# EAGLE design mTouch LED board I2C v1.1_1 (EAGLE 5.10)
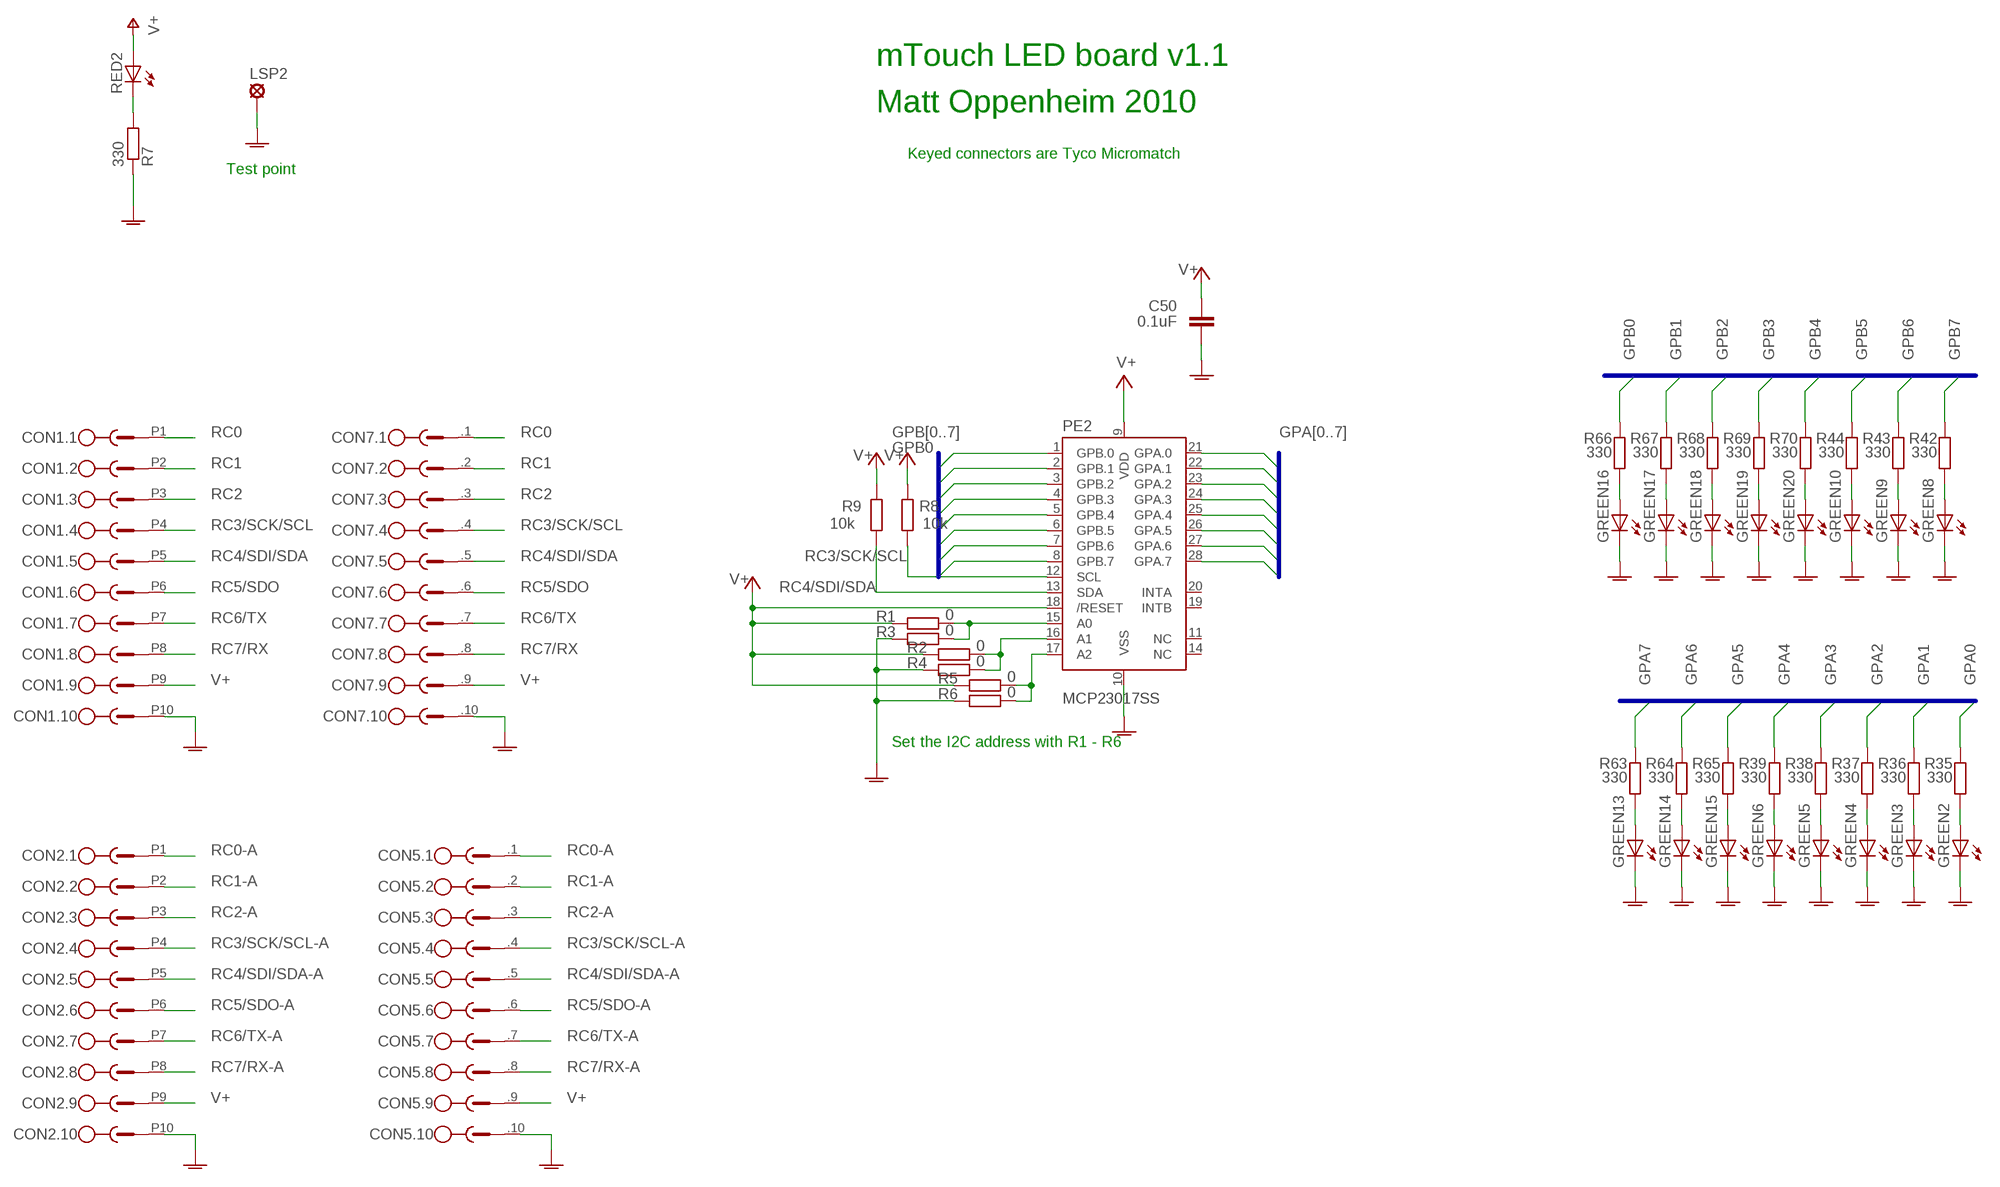
[diagram p0: schematic, sheet 1]

## Parts
C50  0.1uF  C-EUC0603  [C0603]
CON1  MICROMATCH_10HORIZONTAL  [MICROMATCH-10H]
CON2  MICROMATCH_10HORIZONTAL  [MICROMATCH-10H]
CON5  MICROMATCH_10PLUG  [MICROMATCH-10H-PLUG]
CON7  MICROMATCH_10PLUG  [MICROMATCH-10H-PLUG]
GREEN2  LEDCHIP-LED0603  [CHIP-LED0603]
GREEN3  LEDCHIP-LED0603  [CHIP-LED0603]
GREEN4  LEDCHIP-LED0603  [CHIP-LED0603]
GREEN5  LEDCHIP-LED0603  [CHIP-LED0603]
GREEN6  LEDCHIP-LED0603  [CHIP-LED0603]
GREEN8  LEDCHIP-LED0603  [CHIP-LED0603]
GREEN9  LEDCHIP-LED0603  [CHIP-LED0603]
GREEN10  LEDCHIP-LED0603  [CHIP-LED0603]
GREEN13  LEDCHIP-LED0603  [CHIP-LED0603]
GREEN14  LEDCHIP-LED0603  [CHIP-LED0603]
GREEN15  LEDCHIP-LED0603  [CHIP-LED0603]
GREEN16  LEDCHIP-LED0603  [CHIP-LED0603]
GREEN17  LEDCHIP-LED0603  [CHIP-LED0603]
GREEN18  LEDCHIP-LED0603  [CHIP-LED0603]
GREEN19  LEDCHIP-LED0603  [CHIP-LED0603]
GREEN20  LEDCHIP-LED0603  [CHIP-LED0603]
LSP2  LSP10  [LSP10]
PE2  MCP23017SS  [SSOP28]
R1  0  R-EU_R0603  [R0603]
R2  0  R-EU_R0603  [R0603]
R3  0  R-EU_R0603  [R0603]
R4  0  R-EU_R0603  [R0603]
R5  0  R-EU_R0603  [R0603]
R6  0  R-EU_R0603  [R0603]
R7  330  R-EU_R0603  [R0603]
R8  10k  R-EU_R0603  [R0603]
R9  10k  R-EU_R0603  [R0603]
R35  330  R-EU_R0603  [R0603]
R36  330  R-EU_R0603  [R0603]
R37  330  R-EU_R0603  [R0603]
R38  330  R-EU_R0603  [R0603]
R39  330  R-EU_R0603  [R0603]
R42  330  R-EU_R0603  [R0603]
R43  330  R-EU_R0603  [R0603]
R44  330  R-EU_R0603  [R0603]
R63  330  R-EU_R0603  [R0603]
R64  330  R-EU_R0603  [R0603]
R65  330  R-EU_R0603  [R0603]
R66  330  R-EU_R0603  [R0603]
R67  330  R-EU_R0603  [R0603]
R68  330  R-EU_R0603  [R0603]
R69  330  R-EU_R0603  [R0603]
R70  330  R-EU_R0603  [R0603]
RED2  LEDCHIP-LED0603  [CHIP-LED0603]

## Nets
A0: PE2.15(A0) R1.2 R3.1
A1: PE2.16(A1) R2.2 R4.2
A2: PE2.17(A2) R5.2 R6.2
AGND: C50.1 CON1.P10 CON2.P10 CON5..10 CON7..10 GREEN2.C GREEN3.C GREEN4.C GREEN5.C GREEN6.C GREEN8.C GREEN9.C GREEN10.C GREEN13.C GREEN14.C GREEN15.C GREEN16.C GREEN17.C GREEN18.C GREEN19.C GREEN20.C LSP2.MP PE2.10(VSS) R3.2 R4.1 R6.1 R7.1
GPA0: PE2.21(GPA.0) R35.2
GPA1: PE2.22(GPA.1) R36.2
GPA2: PE2.23(GPA.2) R37.2
GPA3: PE2.24(GPA.3) R38.2
GPA4: PE2.25(GPA.4) R39.2
GPA5: PE2.26(GPA.5) R65.2
GPA6: PE2.27(GPA.6) R64.2
GPA7: PE2.28(GPA.7) R63.2
GPB0: PE2.1(GPB.0) R66.2
GPB1: PE2.2(GPB.1) R67.2
GPB2: PE2.3(GPB.2) R68.2
GPB3: PE2.4(GPB.3) R69.2
GPB4: PE2.5(GPB.4) R70.2
GPB5: PE2.6(GPB.5) R44.2
GPB6: PE2.7(GPB.6) R43.2
GPB7: PE2.8(GPB.7) R42.2
N$4: R7.2 RED2.C
N$62: GREEN10.A R44.1
N$63: GREEN9.A R43.1
N$64: GREEN8.A R42.1
N$67: GREEN6.A R39.1
N$68: GREEN5.A R38.1
N$69: GREEN4.A R37.1
N$70: GREEN3.A R36.1
N$71: GREEN2.A R35.1
N$107: GREEN20.A R70.1
N$108: GREEN19.A R69.1
N$109: GREEN18.A R68.1
N$110: GREEN17.A R67.1
N$111: GREEN16.A R66.1
N$112: GREEN15.A R65.1
N$113: GREEN14.A R64.1
N$114: GREEN13.A R63.1
RC0: CON1.P1 CON7..1
RC0-A: CON2.P1 CON5..1
RC1: CON1.P2 CON7..2
RC1-A: CON2.P2 CON5..2
RC2: CON1.P3 CON7..3
RC2-A: CON2.P3 CON5..3
RC3/SCK/SCL: CON1.P4 CON7..4 PE2.12(SCL) R8.1
RC3/SCK/SCL-A: CON2.P4 CON5..4
RC4/SDI/SDA: CON1.P5 CON7..5 PE2.13(SDA) R9.1
RC4/SDI/SDA-A: CON2.P5 CON5..5
RC5/SDO: CON1.P6 CON7..6
RC5/SDO-A: CON2.P6 CON5..6
RC6/TX: CON1.P7 CON7..7
RC6/TX-A: CON2.P7 CON5..7
RC7/RX: CON1.P8 CON7..8
RC7/RX-A: CON2.P8 CON5..8
V+: C50.2 CON1.P9 CON2.P9 CON5..9 CON7..9 PE2.9(VDD) PE2.18(/RESET) R1.1 R2.1 R5.1 R8.2 R9.2 RED2.A
Unconnected: PE2.11(NC) PE2.14(NC) PE2.19(INTB) PE2.20(INTA)

## Buses
GPB[0..7]
GPA[0..7]

## Notes on the sheet
- mTouch LED board v1.1
- Matt Oppenheim 2010
- Keyed connectors are Tyco Micromatch
- Test point
- Set the I2C address with R1 - R6

## Library data of the parts
C50 = rcl:C-EU: CAPACITOR, European symbol
CON1 CON2 CON5 CON7 = con-Micromatch:MICROMATCH_10: MicroMatch 10 way Tyco Electronics, Farnell 148600
GREEN2-GREEN6 GREEN8-GREEN10 GREEN13-GREEN20 RED2 = led:LED: LED OSRAM: - CHIPLED LG R971, LG N971, LY N971, LG Q971, LY Q971, LO R971, LY R971 LH N974, LH R974 LS Q976, LO Q976, LY Q976 LO Q996 - Hyper CHIPLED LW Q18S LB Q993, LB Q99A, LB R99A - SideLED LS A670, LO A670, LY A670, LG A670, LP A670 LB A673, LV A673, LT A673, LW A673 LH A674 LY A675 LS A676, LA A676, LO A676, LY A676, LW A676 LS A679, LY A679, LG A679 - Hyper Micro SIDELED® LS Y876, LA Y876, LO Y876, LY Y876 LT Y87S - SmartLED LW L88C, LW L88S LB L89C, LB L89S, LG L890 LS L89K, LO L89K, LY L89K LS L896, LA L896, LO L896, LY L896 - TOPLED LS T670, LO T670, LY T670, LG T670, LP T670 LSG T670, LSP T670, LSY T670, LOP T670, LYG T670 LG T671, LOG T671, LSG T671 LB T673, LV T673, LT T673, LW T673 LH T674 LS T676, LA T676, LO T676, LY T676, LB T676, LH T676, LSB T676, LW T676 LB T67C, LV T67C, LT T67C, LS T67K, LO T67K, LY T67K, LW E67C LS E67B, LA E67B, LO E67B, LY E67B, LB E67C, LV E67C, LT E67C LW T67C LS T679, LY T679, LG T679 LS T770, LO T770, LY T770, LG T770, LP T770 LB T773, LV T773, LT T773, LW T773 LH T774 LS E675, LA E675, LY E675, LS T675 LS T776, LA T776, LO T776, LY T776, LB T776 LHGB T686 LT T68C, LB T68C - Hyper Mini TOPLED® LB M676 - Mini TOPLED Santana® LG M470 LS M47K, LO M47K, LY M47K Source: http://www.osram.convergy.de LUXEON: - LUMILED® LXK2-PW12-R00, LXK2-PW12-S00, LXK2-PW14-U00, LXK2-PW14-V00 LXK2-PM12-R00, LXK2-PM12-S00, LXK2-PM14-U00 LXK2-PE12-Q00, LXK2-PE12-R00, LXK2-PE12-S00, LXK2-PE14-T00, LXK2-PE14-U00 LXK2-PB12-K00, LXK2-PB12-L00, LXK2-PB12-M00, LXK2-PB14-N00, LXK2-PB14-P00, LXK2-PB14-Q00 LXK2-PR12-L00, LXK2-PR12-M00, LXK2-PR14-Q00, LXK2-PR14-R00 LXK2-PD12-Q00, LXK2-PD12-R00, LXK2-PD12-S00 LXK2-PH12-R00, LXK2-PH12-S00 LXK2-PL12-P00, LXK2-PL12-Q00, LXK2-PL12-R00 Source: www.luxeon.com KINGBRIGHT: KA-3528ASYC Source: www.kingbright.com
LSP2 = Momo:LSP10: SOLDER PAD drill 1.0 mm, distributor Buerklin, 12H555
PE2 = Touch Sensors:MCP23017: MCP23o17 16 bit I/O Expander with I2C Microchip
R1-R9 R35-R39 R42-R44 R63-R70 = rcl:R-EU_: RESISTOR, European symbol

## Board
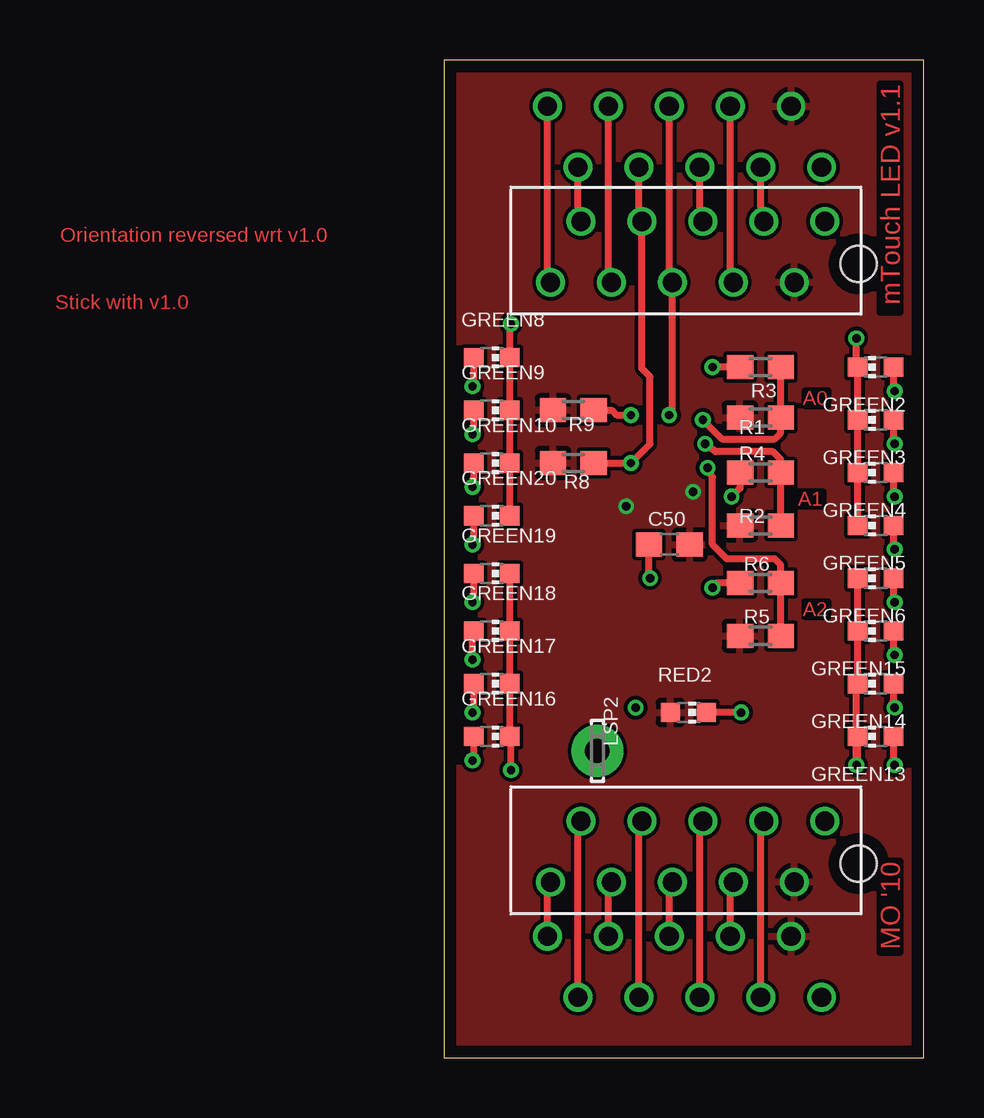
[diagram p1: board, top side]
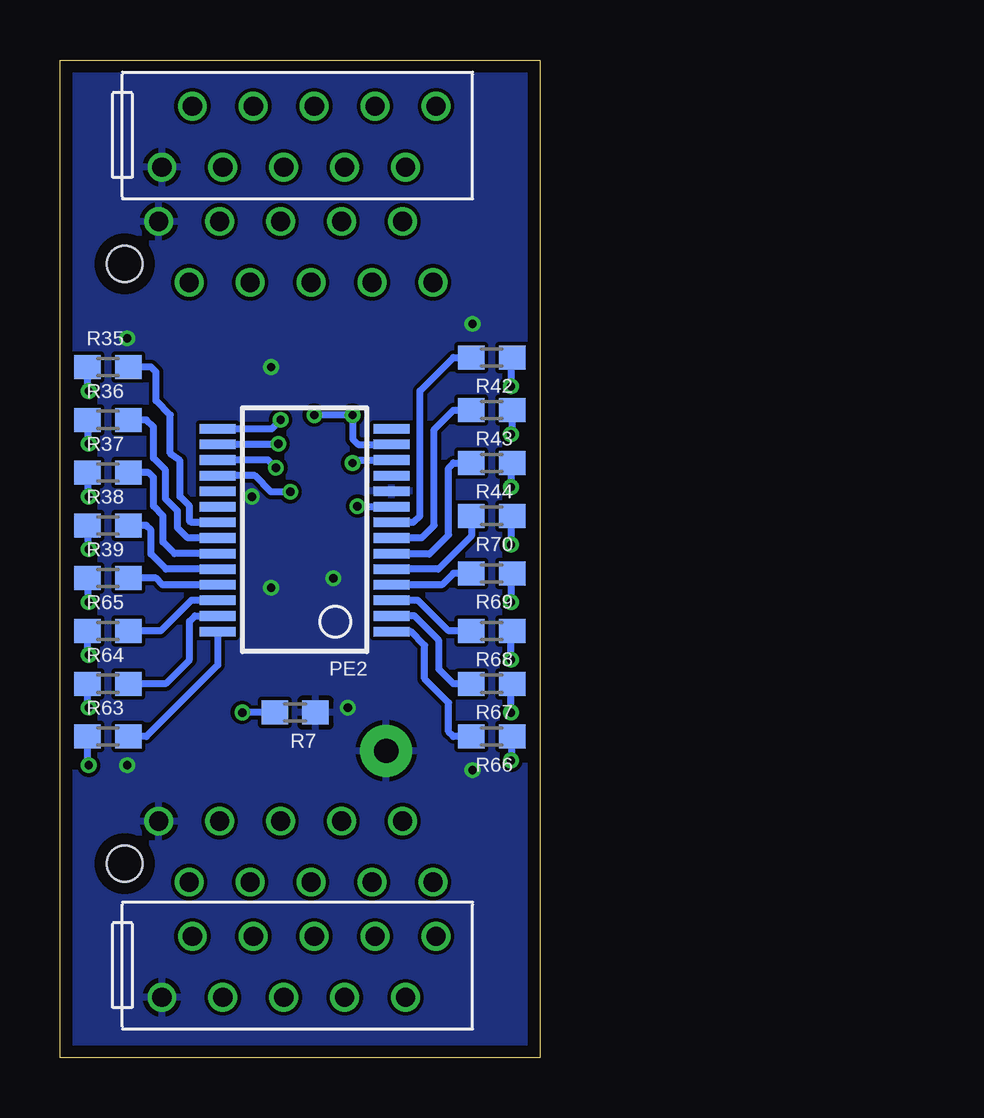
[diagram p2: board, bottom side, seen from below]

Size 20 x 41.6 mm. Coordinates in mm from the lower left corner, seen from the top.
Outline: 20,41.6 0,41.6 0,0 20,0 20,41.6
Copper layers (1*16): Top 0.035mm / dielectric 1.5mm / Bottom 0.035mm
Design rules "PCB-POOL - 2 layer, edited *": minimum track width 6mil, minimum drill 12mil, track to track 6mil, track to pad 8mil, pad to pad 6mil, via to via 6mil, smd to smd 6mil, copper to edge 20mil, drill to drill 8mil, minimum pad ring 8mil, minimum via ring 6mil, stop-mask expansion 3mil, vias tented up to drill 0.35mm, thermal gap 8mil

### Footprints (pad centres in the part's own frame; a part is rotated, then mirrored left to right if it is on the bottom)
C0603 = smd 1.1 x 1: 1 -0.85,0; 2 0.85,0
MICROMATCH-10H = drill 0.8 round: P1 -6.35,-1.27; P2 -5.08,1.27; P3 -3.81,-1.27; P4 -2.54,1.27; P5 -1.27,-1.27; P6 0,1.27; P7 1.27,-1.27; P8 2.54,1.27; P9 3.81,-1.27; P10 5.08,1.27 | hole 1.5: 6.5,-0.5
MICROMATCH-10H-PLUG = drill 0.8 round: .1 5.08,1.27; .2 3.81,-1.27; .3 2.54,1.27; .4 1.27,-1.27; .5 0,1.27; .6 -1.27,-1.27; .7 -2.54,1.27; .8 -3.81,-1.27; .9 -5.08,1.27; .10 -6.35,-1.27
CHIP-LED0603 = smd 0.8 x 0.8: A 0,-0.75; C 0,0.75
LSP10 = drill 1.016 pad 2.159 round: MP 0,0
SSOP28 = smd 0.4 x 1.5: 1 -4.225,-3.625; 2 -3.575,-3.625; 3 -2.925,-3.625; 4 -2.275,-3.625; 5 -1.625,-3.625; 6 -0.975,-3.625; 7 -0.325,-3.625; 8 0.325,-3.625; 9 0.975,-3.625; 10 1.625,-3.625; 11 2.275,-3.625; 12 2.925,-3.625; 13 3.575,-3.625; 14 4.225,-3.625; 15 4.225,3.625; 16 3.575,3.625; 17 2.925,3.625; 18 2.275,3.625; 19 1.625,3.625; 20 0.975,3.625; 21 0.325,3.625; 22 -0.325,3.625; 23 -0.975,3.625; 24 -1.625,3.625; 25 -2.275,3.625; 26 -2.925,3.625; 27 -3.575,3.625; 28 -4.225,3.625
R0603 = smd 1.1 x 1: 1 -0.85,0; 2 0.85,0

### Placement (x,y rotation side)
C50  9.4,21.4 0 top
CON1  10.8,33.6 0 top
CON2  10.8,8.6 0 top
CON5  9.4,3.8 0 bottom
CON7  9.4,38.4 0 bottom
GREEN2  18,28.8 90 top
GREEN3  18,26.6 90 top
GREEN4  18,24.4 90 top
GREEN5  18,22.2 90 top
GREEN6  18,20 90 top
GREEN8  2,29.2 270 top
GREEN9  2,27 270 top
GREEN10  2,24.8 270 top
GREEN13  18,13.4 90 top
GREEN14  18,15.6 90 top
GREEN15  18,17.8 90 top
GREEN16  2,13.4 270 top
GREEN17  2,15.6 270 top
GREEN18  2,17.8 270 top
GREEN19  2,20.2 270 top
GREEN20  2,22.6 270 top
LSP2  6.4,12.8 270 top
PE2  9.8,22 90 bottom
R1  13.2,26.7 0 top
R2  13.2,22.2 0 top
R3  13.2,28.8 180 top
R4  13.2,24.4 0 top
R5  13.2,17.6 0 top
R6  13.2,19.8 0 top
R7  10.2,14.4 180 bottom
R8  5.4,24.8 180 top
R9  5.4,27 180 top
R35  18,28.8 0 bottom
R36  18,26.6 0 bottom
R37  18,24.4 0 bottom
R38  18,22.2 0 bottom
R39  18,20 0 bottom
R42  2,29.2 180 bottom
R43  2,27 180 bottom
R44  2,24.8 180 bottom
R63  18,13.4 0 bottom
R64  18,15.6 0 bottom
R65  18,17.8 0 bottom
R66  2,13.4 180 bottom
R67  2,15.6 180 bottom
R68  2,17.8 180 bottom
R69  2,20.2 180 bottom
R70  2,22.6 180 bottom
RED2  10.2,14.4 270 top

### Tracks (layer width: path | path; a pad name or v marks a point on that pad's centre or on a via)
A0  (via drill 0.35)
  Top 0.3: R3.1 R1.2 14.05,26.05 13.8,25.8 11.6,25.8 v10.8,26.6
  Bottom 0.3: PE2.15 11.18,26.23 v10.8,26.6
A1  (via drill 0.35)
  Top 0.3: R2.2 R4.2 14.05,24.95 13.72,25.27 11.32,25.27 v10.9,25.6
  Bottom 0.3: PE2.16 11.18,25.57 v10.9,25.6
A2  (via drill 0.35)
  Top 0.3: R5.2 R6.2 14.05,20.55 13.8,20.8 11.8,20.8 11.2,21.4 11.2,24.2 v11,24.6
  Bottom 0.3: PE2.17 11.32,24.93 v11,24.6
AGND  (via drill 0.35)
  Top 0.3: R6.1 11.4,19.8 v11.2,19.6 | R3.2 v11.2,28.8 | R4.1 12.35,23.75 v12,23.4 | v17.2,30 17.2,28.85 GREEN2.C GREEN3.C GREEN4.C GREEN5.C | GREEN13.C 17.25,12.25 v17.2,12.2 17.2,15.55 GREEN14.C GREEN15.C GREEN6.C | v2.8,30.6 2.75,30.55 GREEN8.C GREEN9.C GREEN10.C GREEN20.C | v2.8,12 2.8,13.35 GREEN16.C GREEN17.C GREEN18.C GREEN19.C | C50.1 8.55,20.05 v8.6,20
  other vias: 8,14.6
  pour Bottom: 19.4,0.4 0.6,0.4 0.4,0.6 0.4,41 19.6,41
GPA0
  Bottom 0.3: PE2.21 14.53,22.32 14.6,22.4 14.6,23 15,23.4 15,24.9 15.4,25.2 15.4,26.8 16,27.4 16,28.6 16.2,28.8 R35.2
GPA1
  Bottom 0.3: PE2.22 14.68,21.68 15.1,22.1 15.1,22.8 15.6,23.3 15.6,24.5 16.1,25 16.1,26.3 16.4,26.6 R36.2
GPA2
  Bottom 0.3: PE2.23 15.22,21.02 15.7,21.5 15.7,22.6 16.1,23 16.1,24.2 16.3,24.4 R37.2
GPA3
  Bottom 0.3: PE2.24 15.57,20.38 16.2,21 16.2,22 16.4,22.2 R38.2
GPA4
  Bottom 0.3: PE2.25 15.72,19.73 16,20 R39.2
GPA5
  Bottom 0.3: PE2.26 14.53,19.07 15.8,17.8 R65.2
GPA6
  Bottom 0.3: PE2.27 14.38,18.43 14.6,18.2 14.6,16.6 15.6,15.6 R64.2
GPA7
  Bottom 0.3: R63.2 16.4,13.4 13.43,16.38 PE2.28
GPB0
  Bottom 0.3: PE2.1 5.38,17.77 4.8,17.2 4.8,15.8 3.8,14.8 3.8,13.6 3.6,13.4 R66.2
GPB1
  Bottom 0.3: PE2.2 5.22,18.43 4.2,17.4 4.2,16.2 3.6,15.6 R67.2
GPB2
  Bottom 0.3: PE2.3 5.08,19.07 3.8,17.8 R68.2
GPB3
  Bottom 0.3: PE2.4 4.08,19.73 3.6,20.2 R69.2
GPB4
  Bottom 0.3: PE2.5 4.22,20.38 2.85,21.75 R70.2
GPB5
  Bottom 0.3: R44.2 3.6,24.8 3.8,24.6 3.8,21.8 4.6,21 6.15,21 PE2.6
GPB6
  Bottom 0.3: R43.2 3.6,27 4.4,26.2 4.4,22.2 4.92,21.68 PE2.7
GPB7
  Bottom 0.3: PE2.8 5.28,22.32 5,22.6 5,27.8 3.6,29.2 R42.2
N$4  (via drill 0.35)
  Top 0.3: v12.4,14.4 RED2.C
  Bottom 0.3: R7.2 v12.4,14.4
N$62  (via drill 0.35)
  Top 0.3: 1.05,24.85 1.25,24.85 GREEN10.A | GREEN10.A 1.25,23.85 v1.2,23.8 | GREEN10.A R44.1
  Bottom 0.3: v1.2,23.8 1.2,24.75 R44.1
N$63  (via drill 0.35)
  Top 0.3: 1.25,26.85 GREEN9.A 1.25,26.05 v1.2,26
  Bottom 0.3: R43.1 1.15,26.05 v1.2,26
N$64  (via drill 0.35)
  Top 0.3: GREEN8.A 1.25,28.05 v1.2,28
  Bottom 0.3: v1.2,28 1.2,29.15 R42.1
N$67  (via drill 0.35)
  Top 0.3: GREEN6.A 18.75,19.05 v18.8,19
  Bottom 0.3: R39.1 18.85,19.05 v18.8,19
N$68  (via drill 0.35)
  Top 0.3: GREEN5.A 18.75,21.25 v18.8,21.2
  Bottom 0.3: R38.1 18.85,21.25 v18.8,21.2
N$69  (via drill 0.35)
  Top 0.3: v18.8,23.4 18.75,23.45 GREEN4.A R37.1
  Bottom 0.3: R37.1 18.85,23.45 v18.8,23.4
N$70  (via drill 0.35)
  Top 0.3: GREEN3.A 18.75,25.65 v18.8,25.6
  Bottom 0.3: R36.1 18.85,25.65 v18.8,25.6
N$71  (via drill 0.35)
  Top 0.3: GREEN2.A 18.75,27.85 v18.8,27.8
  Bottom 0.3: R35.1 18.85,27.85 v18.8,27.8
N$107  (via drill 0.35)
  Top 0.3: GREEN20.A 1.25,21.45 v1.2,21.4
  Bottom 0.3: v1.2,21.4 1.2,22.55 R70.1
N$108  (via drill 0.35)
  Top 0.3: GREEN19.A 1.25,19.05 v1.2,19
  Bottom 0.3: v1.2,19 1.2,20.15 R69.1
N$109  (via drill 0.35)
  Top 0.3: v1.2,16.6 1.2,17.8 GREEN18.A
  Bottom 0.3: v1.2,16.6 1.2,17.75 R68.1
N$110  (via drill 0.35)
  Top 0.3: GREEN17.A 1.25,14.45 v1.2,14.4
  Bottom 0.3: v1.2,14.4 1.2,15.55 R67.1
N$111  (via drill 0.35)
  Top 0.3: GREEN16.A 1.25,12.45 v1.2,12.4
  Bottom 0.3: R66.1 1.15,12.45 v1.2,12.4
N$112  (via drill 0.35)
  Top 0.3: GREEN15.A 18.75,16.85 v18.8,16.8
  Bottom 0.3: R65.1 18.85,16.85 v18.8,16.8
N$113  (via drill 0.35)
  Top 0.3: GREEN14.A 18.75,14.65 v18.8,14.6
  Bottom 0.3: R64.1 18.85,14.65 v18.8,14.6
N$114  (via drill 0.35)
  Top 0.3: GREEN13.A 18.75,12.25 v18.8,12.2
  Bottom 0.3: R63.1 18.85,12.25 v18.8,12.2
RC0
  Top 0.3: CON7..1 4.32,32.46 CON1.P1
RC0-A
  Top 0.3: CON5..1 4.32,7.2 CON2.P1
RC1
  Top 0.3: CON7..2 5.59,35 CON1.P2
RC1-A
  Top 0.3: CON5..2 5.59,9.74 CON2.P2
RC2
  Top 0.3: CON7..3 6.86,32.46 CON1.P3
RC2-A
  Top 0.3: CON5..3 6.86,7.2 CON2.P3
RC3/SCK/SCL  (via drill 0.35)
  Top 0.3: R8.1 v7.8,24.8 8.6,25.6 8.6,28.4 8.26,28.74 CON1.P4 8.13,35 CON7..4
  Bottom 0.3: PE2.12 7.67,24.93 v7.8,24.8
RC3/SCK/SCL-A
  Top 0.3: CON5..4 8.13,9.74 CON2.P4
RC4/SDI/SDA  (via drill 0.35)
  Top 0.3: R9.1 7,27 7.2,26.8 v7.8,26.8 | CON7..5 9.4,32.46 CON1.P5 9.53,26.93 v9.4,26.8
  Bottom 0.3: PE2.13 7.58,25.57 7.8,25.8 v7.8,26.8 v9.4,26.8
RC4/SDI/SDA-A
  Top 0.3: CON5..5 9.4,7.2 CON2.P5
RC5/SDO
  Top 0.3: CON7..6 10.67,35 CON1.P6
RC5/SDO-A
  Top 0.3: CON5..6 10.67,9.74 CON2.P6
RC6/TX
  Top 0.3: CON7..7 11.94,32.46 CON1.P7
RC6/TX-A
  Top 0.3: CON5..7 11.94,7.2 CON2.P7
RC7/RX
  Top 0.3: CON7..8 13.21,35 CON1.P8
RC7/RX-A
  Top 0.3: CON5..8 13.21,9.74 CON2.P8
V+  (via drill 0.35)
  Bottom 0.3: PE2.18 11.88,24.27 11.2,23.6 v10.4,23.6 | PE2.9 7.58,22.98 v7.6,23
  pour Top: 19.6,0.4 0.4,0.4 0.4,41.2 19.6,41.2

### Text on the board
Top: mTouch LED v1.1 | Orientation reversed wrt v1.0 | Stick with v1.0 | A0 | A1 | A2 | MO '10